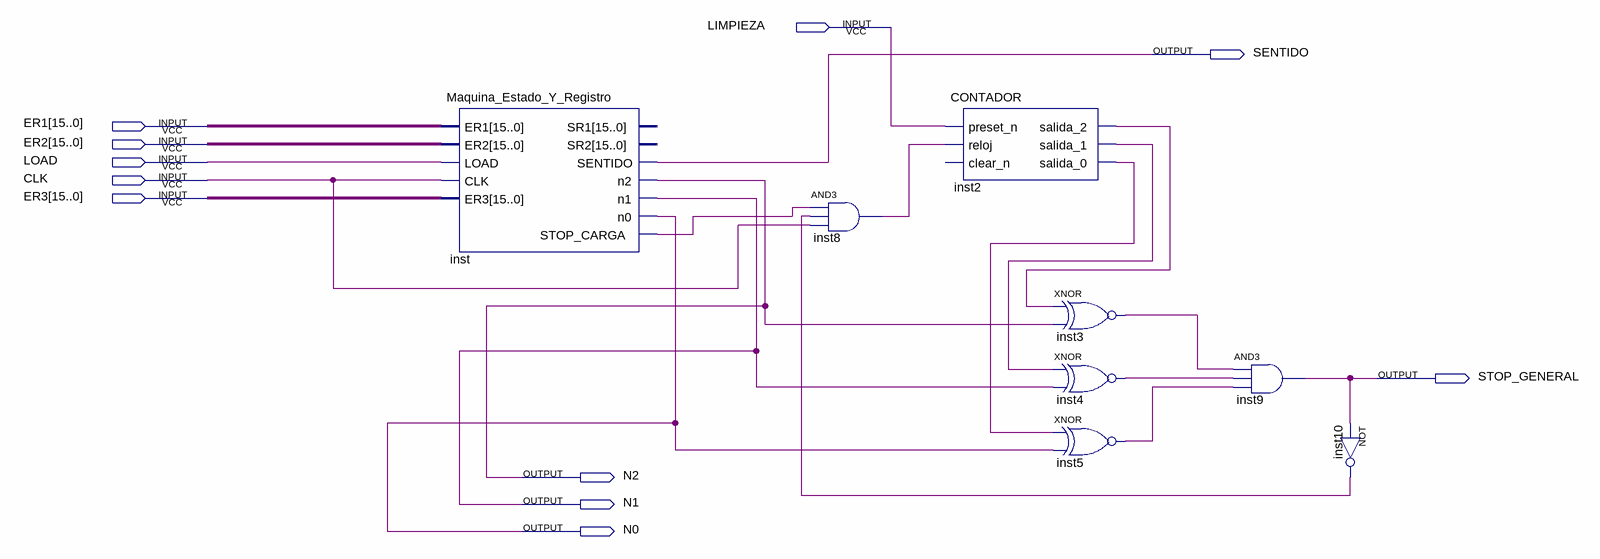
[diagram p0: schematic sheet]
// Quartus schematic ETAPAS_DE_TRANSMISIÓN.bdf as structural Verilog: 8 symbols, 11 pins
module \ETAPAS_DE_TRANSMISIÓN  (
  input  LIMPIEZA,
  input  [15:0] ER1,
  input  [15:0] ER2,
  input  LOAD,
  input  CLK,
  input  [15:0] ER3,
  output SENTIDO,
  output STOP_GENERAL,
  output N2,
  output N1,
  output N0
);

  wire inst2_salida_0, inst2_salida_1, inst2_salida_2, inst3_out, inst4_out, inst5_out, inst8_out,
       inst10_out, inst_stop_carga;

  Maquina_Estado_Y_Registro inst (
    .ER1(ER1), .ER2(ER2), .LOAD(LOAD), .CLK(CLK), .ER3(ER3), .SENTIDO(SENTIDO), .n2(N2), .n1(N1), .n0(N0),
    .STOP_CARGA(inst_stop_carga));  // open: SR1, SR2
  and inst8 (inst8_out, inst_stop_carga, inst10_out, CLK);
  CONTADOR inst2 (
    .preset_n(LIMPIEZA), .reloj(inst8_out), .salida_2(inst2_salida_2), .salida_1(inst2_salida_1),
    .salida_0(inst2_salida_0));  // open: clear_n
  xnor inst3 (inst3_out, inst2_salida_2, N2);
  xnor inst4 (inst4_out, inst2_salida_1, N1);
  xnor inst5 (inst5_out, inst2_salida_0, N0);
  and inst9 (STOP_GENERAL, inst3_out, inst4_out, inst5_out);
  not inst10 (inst10_out, STOP_GENERAL);
endmodule
